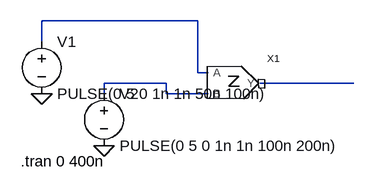
[diagram p0: schematic nor_test.asc]
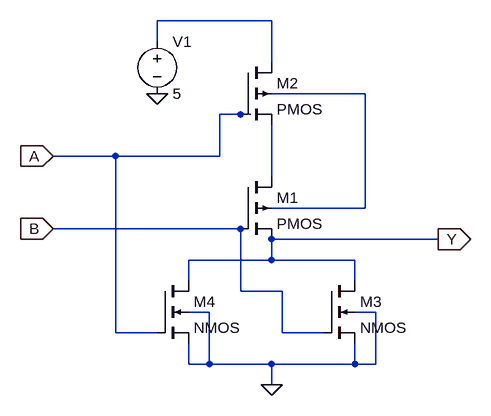
[diagram p1: sub-circuit nor.asc]
nor_test.asc, the LTspice schematic file:
Version 4
SHEET 1 880 680
WIRE 160 80 -80 80
WIRE -80 112 -80 80
WIRE 160 160 160 80
WIRE 176 160 160 160
WIRE 112 176 16 176
WIRE 400 176 256 176
WIRE 16 192 16 176
WIRE 112 192 112 176
WIRE 176 192 112 192
FLAG 16 272 0
FLAG -80 192 0
SYMBOL nor 192 192 R0
SYMATTR InstName X1
SYMBOL voltage -80 96 R0
WINDOW 123 0 0 Left 0
WINDOW 39 0 0 Left 0
SYMATTR InstName V1
SYMATTR Value PULSE(0 5 0 1n 1n 50n 100n)
SYMBOL voltage 16 176 R0
WINDOW 123 0 0 Left 0
WINDOW 39 0 0 Left 0
SYMATTR InstName V2
SYMATTR Value PULSE(0 5 0 1n 1n 100n 200n)
TEXT -112 296 Left 2 !.tran 0 400n

nor.asc, the sub-circuit schematic file:
Version 4
SHEET 1 880 680
WIRE 160 -80 -16 -80
WIRE -16 -48 -16 -80
WIRE 160 -16 160 -80
WIRE 304 32 160 32
WIRE 112 64 80 64
WIRE 128 64 112 64
WIRE -80 128 -176 128
WIRE 80 128 80 64
WIRE 80 128 -80 128
WIRE 160 160 160 80
WIRE 304 208 304 32
WIRE 304 208 160 208
WIRE 112 240 -176 240
WIRE 416 256 160 256
WIRE 160 288 160 256
WIRE 160 288 32 288
WIRE 288 288 160 288
WIRE 32 320 32 288
WIRE 288 320 288 288
WIRE 112 336 112 240
WIRE 176 336 112 336
WIRE 64 368 32 368
WIRE 320 368 288 368
WIRE -80 400 -80 128
WIRE -16 400 -80 400
WIRE 176 400 176 336
WIRE 240 400 176 400
WIRE 32 448 32 416
WIRE 64 448 64 368
WIRE 64 448 32 448
WIRE 160 448 64 448
WIRE 288 448 288 416
WIRE 288 448 160 448
WIRE 320 448 320 368
WIRE 320 448 288 448
WIRE 160 480 160 448
FLAG 416 256 Y
IOPIN 416 256 Out
FLAG -176 128 A
IOPIN -176 128 In
FLAG -176 240 B
IOPIN -176 240 In
FLAG 160 480 0
FLAG -16 32 0
SYMBOL pmos4 112 160 R0
SYMATTR InstName M1
SYMBOL pmos4 112 -16 R0
SYMATTR InstName M2
SYMBOL voltage -16 -64 R0
SYMATTR InstName V1
SYMATTR Value 5
SYMBOL nmos4 240 320 R0
SYMATTR InstName M3
SYMBOL nmos4 -16 320 R0
SYMATTR InstName M4

The netlist it stands for:
* nor_test.asc
XX1 N001 N002 N003 nor
V1 N001 0 PULSE(0 5 0 1n 1n 50n 100n)
V2 N002 0 PULSE(0 5 0 1n 1n 100n 200n)

* block symbol definitions
.subckt nor A B Y
M1 N003 B Y N002 PMOS
M2 N001 A N003 N002 PMOS
V1 N001 0 5
M3 Y B 0 0 NMOS
M4 Y A 0 0 NMOS
.ends nor

.model NMOS NMOS
.model PMOS PMOS
.lib standard.mos
.tran 0 400n
.backanno
.end